# Altium project mdcu.PrjPcb
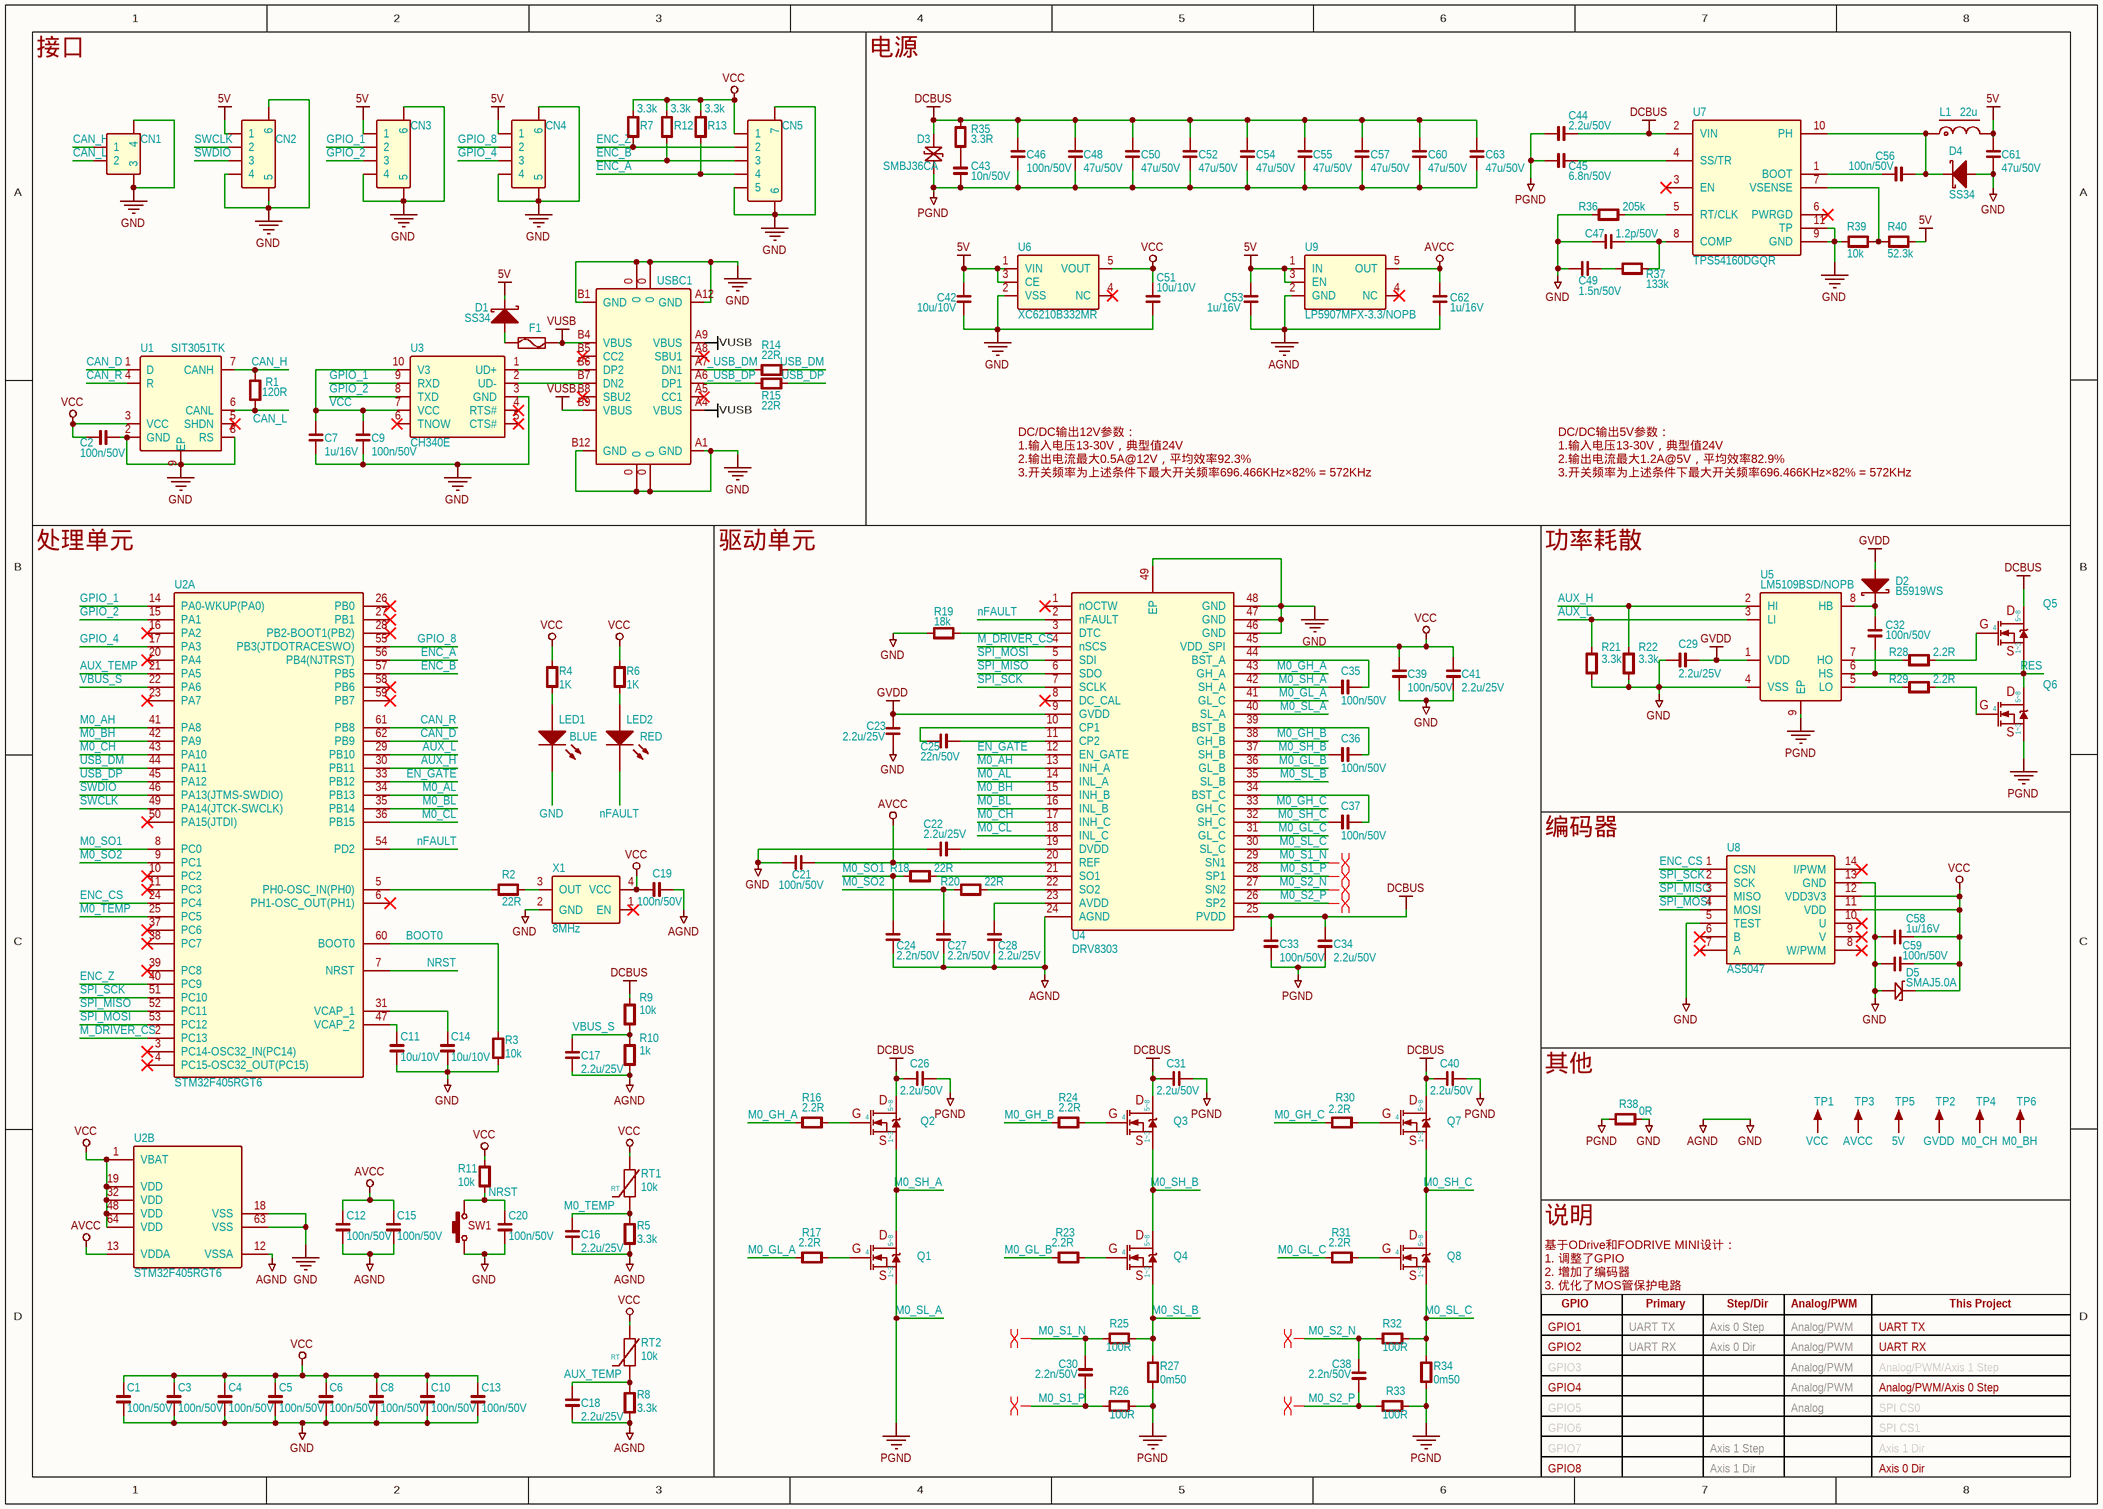
[diagram p0: mdcu.schdoc]
1 sheet, 145 parts. Net scope: global (net labels, ports and power ports of the same name join across sheets).
Board file: mdcu.PcbDoc

## Sheet mdcu.schdoc
size A3; SheetNumber: 1; SheetTotal: 1

### Parts
C1  100n/50V  [C0402_M]
C2  100n/50V  [C0402_M]
C3  100n/50V  [C0402_M]
C4  100n/50V  [C0402_M]
C5  100n/50V  [C0402_M]
C6  100n/50V  [C0402_M]
C7  1u/16V  [C0402_M]
C8  100n/50V  [C0402_M]
C9  100n/50V  [C0402_M]
C10  100n/50V  [C0402_M]
C11  10u/10V  [C0402_M]
C12  100n/50V  [C0402_M]
C13  100n/50V  [C0402_M]
C14  10u/10V  [C0402_M]
C15  100n/50V  [C0402_M]
C16  2.2u/25V  [C0402_M]
C17  2.2u/25V  [C0402_M]
C18  2.2u/25V  [C0402_M]
C19  100n/50V  [C0402_M]
C20  100n/50V  [C0402_M]
C21  100n/50V  [C0402_M]
C22  2.2u/25V  [C0402_M]
C23  2.2u/25V  [C0402_M]
C24  2.2n/50V  [C0402_M]
C25  22n/50V  [C0402_M]
C26  2.2u/50V  [C0603_M]
C27  2.2n/50V  [C0402_M]
C28  2.2u/25V  [C0402_M]
C29  2.2u/25V  [C0402_M]
C30  2.2n/50V  [C0402_M]
C31  2.2u/50V  [C0603_M]
C32  100n/50V  [C0402_M]
C33  100n/50V  [C0402_M]
C34  2.2u/50V  [C0603_M]
C35  100n/50V  [C0402_M]
C36  100n/50V  [C0402_M]
C37  100n/50V  [C0402_M]
C38  2.2n/50V  [C0402_M]
C39  100n/50V  [C0402_M]
C40  2.2u/50V  [C0603_M]
C41  2.2u/25V  [C0402_M]
C42  10u/10V  [C0402_M]
C43  10n/50V  [C0402_M]
C44  2.2u/50V  [C0603_M]
C45  6.8n/50V  [C0402_M]
C46  100n/50V  [C0402_M]
C47  1.2p/50V  [C0402_M]
C48  47u/50V  [C1812_M]
C49  1.5n/50V  [C0402_M]
C50  47u/50V  [C1812_M]
C51  10u/10V  [C0402_M]
C52  47u/50V  [C1812_M]
C53  1u/16V  [C0402_M]
C54  47u/50V  [C1812_M]
C55  47u/50V  [C1812_M]
C56  100n/50V  [C0402_M]
C57  47u/50V  [C1812_M]
C58  1u/16V  [C0402_M]
C59  100n/50V  [C0402_M]
C60  47u/50V  [C1812_M]
C61  47u/50V  [C1812_M]
C62  1u/16V  [C0402_M]
C63  47u/50V  [C1812_M]
CN1  CON-2P  [SH1.0-WT-2P]  (value not drawn)
CN2  CON-4P  [SH1.0-WT-4P]  (value not drawn)
CN3  CON-4P  [SH1.0-WT-4P]  (value not drawn)
CN4  CON-4P  [SH1.0-WT-4P]  (value not drawn)
CN5  CON-5P  [SH1.0-WT-5P]  (value not drawn)
D1  SS34  [SMA]
D2  B5919WS  [SOD-323]
D3  SMBJ36CA  [SMB-NS]
D4  SS34  [SMA]
D5  SMAJ5.0A  [SMA]
F1  FSMD012-1206-R  [FU 1206]  (value not drawn)
L1  22u  [CDRH73]
LED1  BLUE  [LED0603_B]
LED2  RED  [LED0603_R]
Q1  MOSFET-1N-POWER  [PDFN-8-L6-W5-P1.27-3PAD]  (value not drawn)
Q2  MOSFET-1N-POWER  [PDFN-8-L6-W5-P1.27-3PAD]  (value not drawn)
Q3  MOSFET-1N-POWER  [PDFN-8-L6-W5-P1.27-3PAD]  (value not drawn)
Q4  MOSFET-1N-POWER  [PDFN-8-L6-W5-P1.27-3PAD]  (value not drawn)
Q5  MOSFET-1N-POWER  [PDFN-8-L6-W5-P1.27-3PAD]  (value not drawn)
Q6  MOSFET-1N-POWER  [PDFN-8-L6-W5-P1.27-3PAD]  (value not drawn)
Q7  MOSFET-1N-POWER  [PDFN-8-L6-W5-P1.27-3PAD]  (value not drawn)
Q8  MOSFET-1N-POWER  [PDFN-8-L6-W5-P1.27-3PAD]  (value not drawn)
R1  120R  [R0402_M]
R2  22R  [R0402_M]
R3  10k  [R0402_M]
R4  1K  [R0402_M]
R5  3.3k  [R0402_M]
R6  1K  [R0402_M]
R7  3.3k  [R0402_M]
R8  3.3k  [R0402_M]
R9  10k  [R0402_M]
R10  1k  [R0402_M]
R11  10k  [R0402_M]
R12  3.3k  [R0402_M]
R13  3.3k  [R0402_M]
R14  22R  [R0402_M]
R15  22R  [R0402_M]
R16  2.2R  [R0402_M]
R17  2.2R  [R0402_M]
R18  22R  [R0402_M]
R19  18k  [R0402_M]
R20  22R  [R0402_M]
R21  3.3k  [R0402_M]
R22  3.3k  [R0402_M]
R23  2.2R  [R0402_M]
R24  2.2R  [R0402_M]
R25  100R  [R0402_M]
R26  100R  [R0402_M]
R27  0m50  [R2512-HP_M]
R28  2.2R  [R0402_M]
R29  2.2R  [R0402_M]
R30  2.2R  [R0402_M]
R31  2.2R  [R0402_M]
R32  100R  [R0402_M]
R33  100R  [R0402_M]
R34  0m50  [R2512-HP_M]
R35  3.3R  [R0402_M]
R36  205k  [R0402_M]
R37  133k  [R0402_M]
R38  0R  [R0402_M]
R39  10k  [R0402_M]
R40  52.3k  [R0402_M]
RT1  10k  [R0402-HP_M]
RT2  10k  [R0402-HP_M]
SW1  3x6x5  [SW SMD-3*4*2-180]  (value not drawn)
TP1  VCC  [TEST 1]  (value not drawn)
TP2  GVDD  [TEST 1]  (value not drawn)
TP3  AVCC  [TEST 1]  (value not drawn)
TP4  M0_CH  [TEST 1]  (value not drawn)
TP5  5V  [TEST 1]  (value not drawn)
TP6  M0_BH  [TEST 1]  (value not drawn)
U1  SIT3051TK  [DFN-8_L3.0-W3.0-P0.65-BL-EP-M]
U2  STM32F405RGT6  [TQFP64 10x10_M]  (parts A,B of 2)
U3  CH340E  [MSOP10_L]
U4  DRV8303  [HTSSOP-48_L12.5-W6.1-P0.50-M]
U5  LM5109BSD/NOPB  [WSON-8_L4.0-W4.0-P0.80-TL-EP]
U6  XC6210B332MR  [SOT23-5L]
U7  TPS54160DGQR  [MSOP10-L3.0-W3.0-P0.50-EP]
U8  AS5047  [TSSOP14_M]
U9  LP5907MFX-3.3/NOPB  [SOT23-5L]
USBC1  TYPE-C 2.0 -16P  [USB-C-SMD_16P]  (value not drawn)
X1  8MHz  [OSC-2025-4P]

### Nets
5V: C42.2 C53.2 C61.2 CN2.1 CN3.1 CN4.1 D1.2(K) L1.2 R40.1 TP5.1 U6.1(VIN) U6.3(CE) U9.1(IN) U9.3(EN)
AVCC: C12.2 C15.2 C21.1 C62.2 TP3.1 U2.13(VDDA) U4.20(REF) U9.5(OUT)
DCBUS: C26.2 C31.2 C33.2 C34.2 C40.2 C44.2 C46.2 C48.2 C50.2 C52.2 C54.2 C55.2 C57.2 C60.2 C63.2 D3.1(A) Q2.D Q3.D Q5.D Q7.D R9.1 R35.1 U4.25(PVDD) U7.2(VIN)
GND: C1.1 C2.1 C3.1 C4.1 C5.1 C6.1 C7.1 C8.1 C9.1 C10.1 C11.1 C12.1 C13.1 C14.1 C15.1 C16.1 C17.1 C18.1 C19.1 C20.1 C21.2 C22.2 C23.1 C24.1 C27.1 C28.1 C29.1 C39.1 C41.1 C42.1 C47.1 C49.1 C51.1 C53.1 C58.1 C59.1 C61.1 C62.1 CN1.3 CN1.4 CN2.4 CN2.5 CN2.6 CN3.4 CN3.5 CN3.6 CN4.4 CN4.5 CN4.6 CN5.5 CN5.6 CN5.7 D4.1(A) D5.1(A) LED1.2(K) R3.2 R5.2 R8.2 R10.2 R19.2 R21.2 R22.2 R36.2 R38.2 R39.2 SW1.1 U1.2(GND) U1.8(RS) U1.9(EP) U2.12(VSSA) U2.18(VSS) U2.63(VSS) U3.3(GND) U4.24(AGND) U4.46(GND) U4.47(GND) U4.48(GND) U4.49(EP) U5.4(VSS) U6.2(VSS) U7.9(GND) U7.11(TP) U8.5(TEST) U8.13(GND) U9.2(GND) USBC1.0 USBC1.A1(GND) USBC1.A12(GND) USBC1.B1(GND) USBC1.B12(GND) X1.2(GND)  [also labelled AGND]
GVDD: C23.2 C29.2 D2.1(A) TP2.1 U4.9(GVDD) U5.1(VDD)
M0_SL_A: C26.1 C31.1 C33.1 C34.1 C40.1 C43.1 C44.1 C45.1 C46.1 C48.1 C50.1 C52.1 C54.1 C55.1 C57.1 C60.1 C63.1 D3.2(K) Q1.S Q6.S R26.2 R27.1 R33.2 R34.1 R38.1 U4.40(SL_A) U5.9(EP)  [also labelled PGND]
VCC: C1.2 C2.2 C3.2 C4.2 C5.2 C6.2 C7.2 C8.2 C9.2 C10.2 C13.2 C19.2 C39.2 C41.2 C51.2 C58.2 C59.2 CN5.1 D5.2(K) R4.2 R6.2 R7.1 R11.1 R12.1 R13.1 RT1.2 RT2.2 TP1.1 U1.3(VCC) U2.1(VBAT) U2.19(VDD) U2.32(VDD) U2.48(VDD) U2.64(VDD) U3.7(VCC) U3.10(V3) U4.45(VDD_SPI) U6.5(VOUT) U8.11(VDD) U8.12(VDD3V3) X1.4(VCC)
VUSB: F1.1 USBC1.A4(VBUS) USBC1.A9(VBUS) USBC1.B4(VBUS) USBC1.B9(VBUS)
_USB_DM: R14.2 USBC1.A7(DN1)
_USB_DP: R15.2 USBC1.A6(DP1)
AUX_H: R22.1 U2.30(PB11) U5.2(HI)
AUX_L: R21.1 U2.29(PB10) U5.3(LI)
AUX_TEMP: C18.2 R8.1 RT2.1 U2.21(PA5)
BOOT0: R3.1 U2.60(BOOT0)
CAN_D: U1.1(D) U2.62(PB9)
CAN_H: CN1.1 R1.1 U1.7(CANH)
CAN_L: CN1.2 R1.2 U1.6(CANL)
CAN_R: U1.4(R) U2.61(PB8)
EN_GATE: U2.33(PB12) U4.12(EN_GATE)
ENC_A: CN5.4 R13.2 U2.56(PB4(NJTRST))
ENC_B: CN5.3 R12.2 U2.57(PB5)
ENC_CS: U2.24(PC4) U8.1(CSN)
ENC_Z: CN5.2 R7.2 U2.40(PC9)
GPIO_1: CN3.2 U2.14(PA0-WKUP(PA0)) U3.9(RXD)
GPIO_2: CN3.3 U2.15(PA1) U3.8(TXD)
GPIO_4: CN4.3 U2.17(PA3)
GPIO_8: CN4.2 U2.55(PB3(JTDOTRACESWO))
M0_AH: U2.41(PA8) U4.13(INH_A)
M0_AL: U2.34(PB13) U4.14(INL_A)
M0_BH: TP6.1 U2.42(PA9) U4.15(INH_B)
M0_BL: U2.35(PB14) U4.16(INL_B)
M0_CH: TP4.1 U2.43(PA10) U4.17(INH_C)
M0_CL: U2.36(PB15) U4.18(INL_C)
M0_GH_A: R16.2 U4.43(GH_A)
M0_GH_B: R24.2 U4.38(GH_B)
M0_GH_C: R30.2 U4.33(GH_C)
M0_GL_A: R17.2 U4.41(GL_C)
M0_GL_B: R23.2 U4.36(GL_B)
M0_GL_C: R31.2 U4.31(GL_C)
M0_S1_N: C30.2 R25.1 U4.29(SN1)
M0_S1_P: C30.1 R26.1 U4.28(SP1)
M0_S2_N: C38.2 R32.1 U4.27(SN2)
M0_S2_P: C38.1 R33.1 U4.26(SP2)
M0_SH_A: C35.1 Q1.D Q2.S U4.42(SH_A)
M0_SH_B: C36.1 Q3.S Q4.D U4.37(SH_B)
M0_SH_C: C37.1 Q7.S Q8.D U4.32(SH_C)
M0_SL_B: Q4.S R25.2 R27.2 U4.35(SL_B)
M0_SL_C: Q8.S R32.2 R34.2 U4.30(SL_C)
M0_SO1: C24.2 R18.2 U2.8(PC0)
M0_SO2: C27.2 R20.2 U2.9(PC1)
M0_TEMP: C16.2 R5.1 RT1.1 U2.25(PC5)
M_DRIVER_CS: U2.2(PC13) U4.4(nSCS)
nFAULT: LED2.2(K) U2.54(PD2) U4.2(nFAULT)
NRST: C20.2 R11.2 SW1.2 U2.7(NRST)
RES: C32.1 Q5.S Q6.D U5.6(HS)
SPI_MISO: U2.52(PC11) U4.6(SDO) U8.3(MISO)
SPI_MOSI: U2.53(PC12) U4.5(SDI) U8.4(MOSI)
SPI_SCK: U2.51(PC10) U4.7(SCLK) U8.2(SCK)
SWCLK: CN2.2 U2.49(PA14(JTCK-SWCLK))
SWDIO: CN2.3 U2.46(PA13(JTMS-SWDIO))
USB_DM: R14.1 U2.44(PA11)
USB_DP: R15.1 U2.45(PA12)
VBUS_S: C17.2 R9.2 R10.1 U2.22(PA6)
NetC11_2: C11.2 U2.47(VCAP_2)
NetC14_2: C14.2 U2.31(VCAP_1)
NetC22_1: C22.1 U4.19(DVDD)
NetC25_1: C25.1 U4.10(CP1)
NetC25_2: C25.2 U4.11(CP2)
NetC28_2: C28.2 U4.23(AVDD)
NetC32_2: C32.2 D2.2(K) U5.8(HB)
NetC35_2: C35.2 U4.44(BST_A)
NetC36_2: C36.2 U4.39(BST_B)
NetC37_2: C37.2 U4.34(BST_C)
NetC43_2: C43.2 R35.2
NetC45_2: C45.2 U7.4(SS/TR)
NetC47_2: C47.2 R37.1 U7.8(COMP)
NetC49_2: C49.2 R37.2
NetC56_1: C56.1 U7.1(BOOT)
NetC56_2: C56.2 D4.2(K) L1.1 U7.10(PH)
NetD1_1: D1.1(A) F1.2
NetLED1_1: LED1.1(A) R4.1
NetLED2_1: LED2.1(A) R6.1
NetQ1_G: Q1.G R17.1
NetQ2_G: Q2.G R16.1
NetQ3_G: Q3.G R24.1
NetQ4_G: Q4.G R23.1
NetQ5_G: Q5.G R28.1
NetQ6_G: Q6.G R29.1
NetQ7_G: Q7.G R30.1
NetQ8_G: Q8.G R31.1
NetR2_1: R2.1 U2.5(PH0-OSC_IN(PH0))
NetR2_2: R2.2 X1.3(OUT)
NetR18_1: R18.1 U4.21(SO1)
NetR19_1: R19.1 U4.3(DTC)
NetR20_1: R20.1 U4.22(SO2)
NetR28_2: R28.2 U5.7(HO)
NetR29_2: R29.2 U5.5(LO)
NetR36_1: R36.1 U7.5(RT/CLK)
NetR39_1: R39.1 R40.2 U7.7(VSENSE)
NetU3_1: U3.1(UD+) USBC1.B6(DP2)
NetU3_2: U3.2(UD-) USBC1.B7(DN2)

Not connected (* = marked no-connect by the designer): U1 5(SHDN)*; U2 3(PC14-OSC32_IN(PC14))* 4(PC15-OSC32_OUT(PC15))* 6(PH1-OSC_OUT(PH1))* 10(PC2)* 11(PC3)* 16(PA2)* 20(PA4)* 23(PA7)* 26(PB0)* 27(PB1)* 28(PB2-BOOT1(PB2))* 37(PC6)* 38(PC7)* 39(PC8)* 50(PA15(JTDI))* 58(PB6)* 59(PB7)*; U3 4(RTS#)* 5(CTS#)* 6(TNOW)*; U4 1(nOCTW)* 8(DC_CAL)*; U6 4(NC)*; U7 3(EN)* 6(PWRGD)*; U8 6(B)* 7(A)* 8(W/PWM)* 9(V)* 10(U)* 14(I/PWM)*; U9 4(NC)*; USBC1 A5(CC1)* A8(SBU1)* B5(CC2)* B8(SBU2)*; X1 1(EN)*

### Layout directives
differential pair: M0_S1_N, M0_S1_P, M0_S2_N, M0_S2_P

### Notes on the sheet
- 接口
- 电源
- DC/DC输出12V参数：
  1.输入电压13-30V，典型值24V
  2.输出电流最大0.5A@12V，平均效率92.3%
  3.开关频率为上述条件下最大开关频率696.466KHz×82% = 572KHz
- DC/DC输出5V参数：
  1.输入电压13-30V，典型值24V
  2.输出电流最大1.2A@5V，平均效率82.9%
  3.开关频率为上述条件下最大开关频率696.466KHz×82% = 572KHz
- 处理单元
- 驱动单元
- 功率耗散
- 编码器
- 其他
- 说明
- 基于ODrive和FODRIVE MINI设计：
  1. 调整了GPIO
  2. 增加了编码器
  3. 优化了MOS管保护电路
- GPIO
- Primary
- Step/Dir
- Analog/PWM
- This Project
- GPIO4
- GPIO3
- GPIO2
- GPIO1
- UART RX
- UART TX
- Axis 0 Step
- Axis 0 Dir
- Analog/PWM/Axis 0 Step
- Analog/PWM/Axis 1 Step
- GPIO5
- GPIO7
- GPIO6
- Axis 1 Step
- Analog
- Axis 1 Dir
- SPI CS1
- SPI CS0
- GPIO8
- (in symbol MOSFET-1N-POWER) 5~8; 4; 1~3

### Library data of the parts
C1-C63 = C: 贴片电容/MLCC电容; BOM名称: 无极性贴片电容; 联系下单店铺卖家 免费帮你查找封装: 联系下单店铺卖家 免费技术支持
CN1 = Header 2: 2P连接器; 联系卖家 免费查找封装: 唯一出售店铺网址https://shop463601444.taobao.com; 联系卖家 免费技术支持: 封装库来自淘宝卖家ID：黄晶宝石; BOM名称: 2P连接器
CN2-CN4 = Header 4: 4P连接器; 联系卖家 免费查找封装: 唯一出售店铺网址https://shop463601444.taobao.com; 联系卖家 免费技术支持: 封装库来自淘宝卖家ID：黄晶宝石; BOM名称: 4P连接器
CN5 = Header 5: 5P连接器; 联系卖家 免费查找封装: 唯一出售店铺网址https://shop463601444.taobao.com; 联系卖家 免费技术支持: 封装库来自淘宝卖家ID：黄晶宝石; BOM名称: 5P连接器
D1 D4 = SS34: 肖特基二极管; 属性: 40V/3A; 以赠品形式获赠本封装库的买家，还可联系卖家免费指导AD软件使用: 封装库来自淘宝卖家ID：黄晶宝石; BOM名称: 肖特基二极管
D2 = B5819: 肖特基二极管; 以赠品形式获赠本封装库的买家，还可联系卖家免费指导AD软件使用: 封装库来自淘宝卖家ID：黄晶宝石; BOM名称: 肖特基二极管
D3 = DR_CA: 瞬态电压抑制二极管-双向; 以赠品形式获赠本封装库的买家，还可联系卖家免费指导AD软件使用: 封装库来自淘宝卖家ID：黄晶宝石; BOM名称: 瞬态电压抑制二极管
D5 = DR: 瞬态电压抑制二极管-单向; 以赠品形式获赠本封装库的买家，还可联系卖家免费指导AD软件使用: 封装库来自淘宝卖家ID：黄晶宝石; BOM名称: 瞬态电压抑制二极管
F1 = FU-PPTC: PPTC自恢复保险丝; 联系卖家，免费查找封装: 唯一出售店铺网址https://shop463601444.taobao.com; 封装库来自淘宝卖家：黄晶宝石: 其他店铺购入均为盗版封装库，请立即申请退款，本店现金奖励200~1000元; BOM名称: PPTC自恢复保险丝
L1 = L-CDRH: CDRH功率屏蔽电感; BOM名称: 功率屏蔽电感; 联系下单店铺卖家 免费帮你查找封装: 联系下单店铺卖家 免费技术支持
LED1 LED2 = LED: 贴片LED; 封装库来自淘宝卖家：黄晶宝石: 其他店铺购入均为盗版封装库，请立即申请退款，本店现金奖励200~1000元; BOM名称: 贴片LED
Q1-Q8 = MOSFET-1N-POWER: N沟道功率型场效应管; MF: ON Semiconductor; MP: NTMFS4935NT1G; Value: *; Purchase-URL: https://pricing.snapeda.com/search/part/NTMFS4935NT1G/?ref=eda; Price: None; Check_prices: https://www.snapeda.com/parts/NTMFS4935NT1G/Onsemi/view-part/51639/?ref=eda; Package: SO-8 ON Semiconductor; Availability: In Stock; SnapEDA_Link: https://www.snapeda.com/parts/NTMFS4935NT1G/Onsemi/view-part/51639/?ref=snap
R1-R26 R28-R33 R35-R40 = R: 贴片电阻; 联系下单店铺卖家 免费帮你查找封装: 联系下单店铺卖家 免费技术支持; BOM名称: 贴片电阻
R27 R34 = R-High Precision: 贴片精密电阻; BOM名称: 精密电阻; 联系下单店铺卖家 免费帮你查找封装: 联系下单店铺卖家 免费技术支持
RT1 RT2 = RT: 热敏电阻; BOM名称: 压敏电阻; 联系下单店铺卖家 免费帮你查找封装: 联系下单店铺卖家 免费技术支持
SW1 = SW-PB: 微动开关; BOM名称: 3x6轻触开关; 联系卖家，免费查找封装: 唯一出售店铺网址https://shop463601444.taobao.com; 封装库来自淘宝卖家：黄晶宝石: 其他店铺购入均为盗版封装库，请立即申请退款，本店现金奖励200~1000元
TP1-TP6 = TEST: 测试点; 联系卖家，免费查找封装: 唯一出售店铺网址https://shop463601444.taobao.com; 封装库来自淘宝卖家：黄晶宝石: 其他店铺购入均为盗版封装库，请立即申请退款，本店现金奖励200~1000元; BOM名称: 测试点
U1 = SIT3051TK: CAN芯片; BOM名称: CAN芯片
U2 = STM32F405RGT6_V2: BOM_Manufacturer: ST; subpart_no: 1; tags: STM32; BOM_Supplier Part: C15742; BOM_Supplier: LCSC; BOM_Manufacturer Part: STM32F405RGT6; image: http://image.lceda.cn/szlcsc/C15742.jpg; BOM_JLCPCB Part Class: Extended Part; spicePre: U; spiceSymbolName: STM32F405RGT6
U3 = CH340E: USB转串口芯片，内置时钟; BOM名称: 串口转USB; 联系下单店铺卖家 免费帮你查找封装: 唯一出售店铺网址https://shop463601444.taobao.com; 芯片厂商: WCH(南京沁恒)
U4 = DRV8303: 三相电机驱动应用的栅极驱动 / 器; Contributor: 矛盾聚合体; BOM_Supplier: LCSC; BOM_Supplier Part: C91880; spicePre: U; spiceSymbolName: DRV8303
U5 = LM5109: USB转串口芯片，内置时钟; BOM名称: 串口转USB; 联系下单店铺卖家 免费帮你查找封装: 唯一出售店铺网址https://shop463601444.taobao.com; 芯片厂商: WCH(南京沁恒)
U6 = XC6210: LDO 0.9A/3.3V
U7 = TPS54160DGQR: DC-DC 1.5A/60V 降压转换器
U8 = AS5047: AMS公司14位磁编码器; BOM名称: 串口转USB; 版权归属: 封装库来自淘宝 ID：黄晶宝石; 学习资源: https://shop463601444.taobao.com
U9 = LP5907: LDO 0.25A/3.3V 90dB@(100Hz),60dB@(100kHz)
USBC1 = USB2.0_Type-C_16Pin: USB2.0_Type-C_16Pin母座; 联系下单店铺卖家 免费帮你查找封装: 封装库来自淘宝卖家ID：黄晶宝石
X1 = XTAL-ACT-4P: 4脚有源晶振(振荡器); 联系下单店铺卖家 免费帮你查找封装: 联系下单店铺卖家 免费技术支持; BOM名称: 有源晶振(振荡器)